# Altium schematic sheet debug.SchDoc
size A4; SheetNumber: 7; SheetTotal: 6
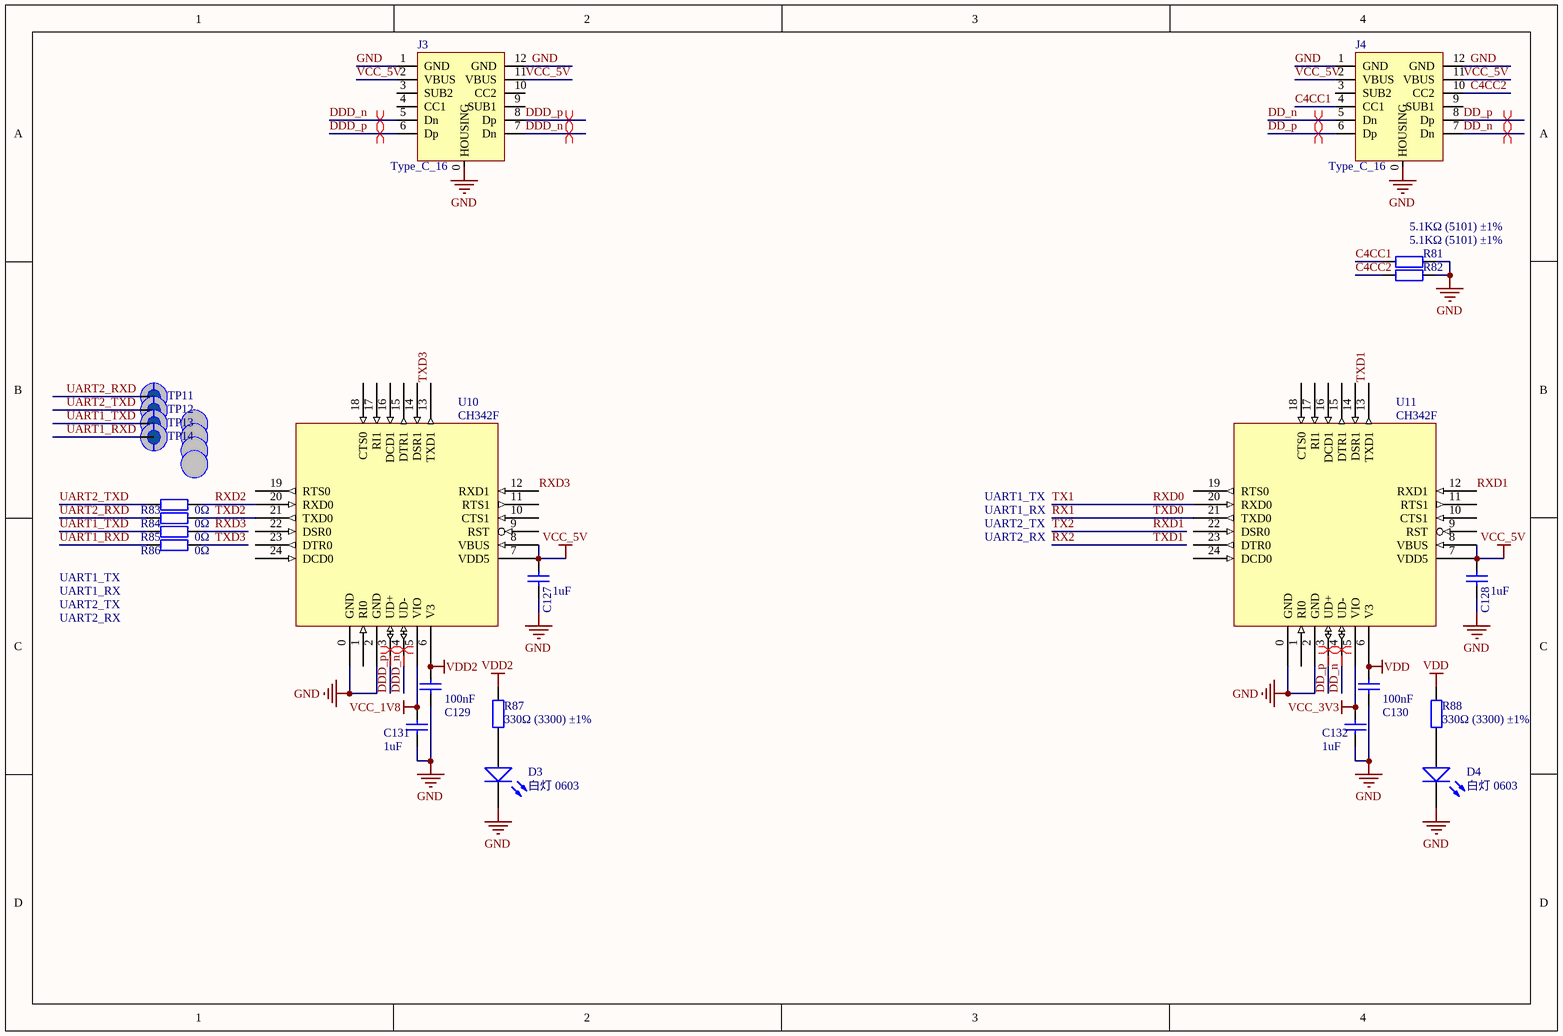
[diagram p0: debug.SchDoc]

## Parts
C127  1uF  [0805_C]
C128  1uF  [0805_C]
C129  100nF  [0805_C]
C130  100nF  [0805_C]
C131  1uF  [0805_C]
C132  1uF  [0805_C]
D3  白灯 0603  [0805_LED_S1]
D4  白灯 0603  [0805_LED_S1]
J3  Type_C_16  [USB type C  16pin]
J4  Type_C_16  [USB type C  16pin]
R81  5.1KΩ (5101) ±1%  [0402_R]
R82  5.1KΩ (5101) ±1%  [0402_R]
R83  0Ω  [0805_R]
R84  0Ω  [0805_R]
R85  0Ω  [0805_R]
R86  0Ω  [0805_R]
R87  330Ω (3300) ±1%  [0805_R]
R88  330Ω (3300) ±1%  [0805_R]
TP11  test-point  [POINT]  (value not drawn)
TP12  test-point  [POINT]  (value not drawn)
TP13  test-point  [POINT]  (value not drawn)
TP14  test-point  [POINT]  (value not drawn)
U10  CH342F  [QFN24_4X4]
U11  CH342F  [QFN24_4X4]

## Nets
GND: C127.1 C128.1 C129.1 C130.1 C131.1 C132.1 D3.K D4.K J3.0(HOUSING) J3.1(GND) J3.12(GND) J4.0(HOUSING) J4.1(GND) J4.12(GND) R81.1 R82.1 U10.0(GND) U10.2(GND) U11.0(GND) U11.2(GND)
VCC_1V8: C131.2 U10.5(VIO)
VCC_3V3: C132.2 U11.5(VIO)
VCC_5V: C127.2 C128.2 J3.2(VBUS) J3.11(VBUS) J4.2(VBUS) J4.11(VBUS) U10.7(VDD5) U10.8(VBUS) U11.7(VDD5) U11.8(VBUS)
VDD: C130.2 R88.2 U11.6(V3)
VDD2: C129.2 R87.2 U10.6(V3)
C4CC1: J4.4(CC1) R81.2
C4CC2: J4.10(CC2) R82.2
DD_n: J4.5(Dn) J4.7(Dn) U11.4(UD-)
DD_p: J4.6(Dp) J4.8(Dp) U11.3(UD+)
DDD_n: J3.5(Dn) J3.7(Dn) U10.4(UD-)
DDD_p: J3.6(Dp) J3.8(Dp) U10.3(UD+)
RX1: U11.21(TXD0)  [also labelled TXD0]
RX2: U11.13(TXD1)  [also labelled TXD1]
RXD0: U11.20(RXD0)  [also labelled TX1]
RXD1: U11.12(RXD1)  [also labelled TX2]
RXD2: R83.2 U10.20(RXD0)
RXD3: R85.2 U10.12(RXD1)
TXD2: R84.2 U10.21(TXD0)
TXD3: R86.2 U10.13(TXD1)
UART1_RXD: R86.1 TP14.1(point)
UART1_TXD: R85.1 TP13.1(point)
UART2_RXD: R84.1 TP11.1(point)
UART2_TXD: R83.1 TP12.1(point)
NetD3_A: D3.A R87.1
NetD4_A: D4.A R88.1

Not connected (* = marked no-connect by the designer): J3 3(SUB2) 4(CC1) 9(SUB1) 10(CC2); J4 3(SUB2) 9(SUB1); U10 1(RI0) 9(RST) 10(CTS1) 11(RTS1) 14(DSR1) 15(DTR1) 16(DCD1) 17(RI1) 18(CTS0) 19(RTS0) 22(DSR0) 23(DTR0) 24(DCD0); U11 1(RI0) 9(RST) 10(CTS1) 11(RTS1) 14(DSR1) 15(DTR1) 16(DCD1) 17(RI1) 18(CTS0) 19(RTS0) 22(DSR0) 23(DTR0) 24(DCD0)

## Layout directives
differential pair: DD_n, DD_p, DDD_n, DDD_p

## Notes on the sheet
- UART1_TX
- UART1_RX
- UART2_TX
- UART2_RX

## Library data of the parts
C127 C128 C131 C132 = 0603 1uF (105) 10% 50V: 贴片电容; ComponentLink1Description: 供应商链接; ComponentLink1URL: http://www.szlcsc.com/product/details_16531.html; Package: 0603; Supplier: LC; SuppliersPartNumber: C15849
C129 C130 = 0402 100nF (104) 10% 16V: 贴片电容; ComponentLink1Description: 供应商链接; ComponentLink1URL: http://www.szlcsc.com/product/details_1877.html; Package: 0402; Supplier: LC; SuppliersPartNumber: C1525
D3 D4 = 0603 白灯: 发光二极管; ComponentLink1Description: 供应商链接; ComponentLink1URL: http://www.szlcsc.com/product/details_2663.html; Package: 0603; Supplier: LC; SuppliersPartNumber: C2290
J3 J4 = Type_C_16: USB type C 16pin
R81 R82 = 0402 5.1KΩ (5101) 1%: 贴片电阻; ComponentLink1Description: 供应商链接; ComponentLink1URL: http://www.szlcsc.com/product/details_26648.html; Package: 0402; Supplier: LC; SuppliersPartNumber: C25905
R83-R86 = 0805 0Ω (0R0) 1%: 贴片电阻; ComponentLink1Description: 供应商链接; ComponentLink1URL: http://www.szlcsc.com/product/details_18165.html; Package: 0805; Supplier: LC; SuppliersPartNumber: C17477
R87 R88 = 0402 330Ω (3300) 1%: 贴片电阻; ComponentLink1Description: 供应商链接; ComponentLink1URL: http://www.szlcsc.com/product/details_25847.html; Package: 0402; Supplier: LC; SuppliersPartNumber: C25104
TP11-TP14 = test-point: 测试点
U10 U11 = CH342F: USB to dual enhanced TTL Serial / 2*UART